# EAGLE schematic arduino-pro-micro (EAGLE 6.5.0)
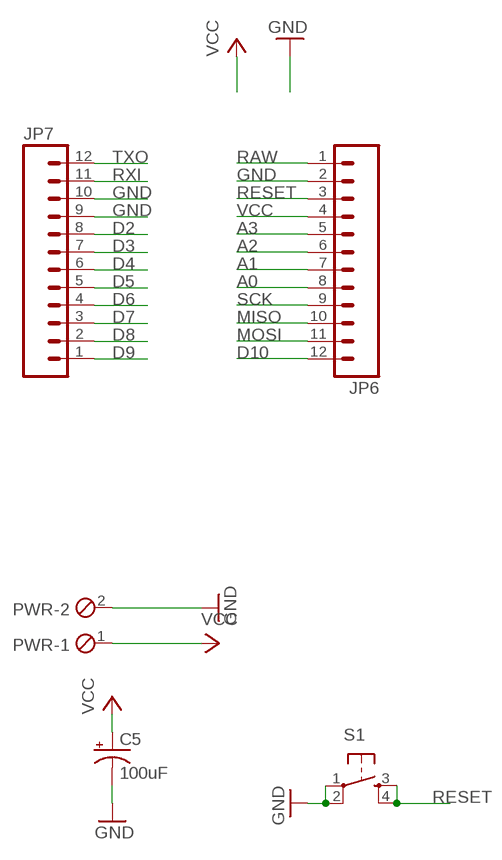
[diagram p0: schematic, sheet 1]

## Parts
C5  100uF  CPOL-USE3.5-8  [E3,5-8]
JP6  M12PTH  [1X12]
JP7  M12PTH  [1X12]
PWR  MPT2  [2POL254]
S1  TAC_SWITCHPTH  [TACTILE-PTH]

## Nets
A0: JP6.8
A1: JP6.7
A2: JP6.6
A3: JP6.5
D2: JP7.8
D3: JP7.7
D4: JP7.6
D5: JP7.5
D6: JP7.4
D7: JP7.3
D8: JP7.2
D9: JP7.1
D10: JP6.12
GND [vcc]: C5.- JP6.2 JP7.9 JP7.10 PWR.2 S1.1 S1.2
MISO: JP6.10
MOSI: JP6.11
RAW [vcc]: JP6.1
RESET: JP6.3 S1.3 S1.4
RXI: JP7.11
SCK: JP6.9
TXO: JP7.12
VCC: C5.+ JP6.4 PWR.1

## Library data of the parts
C5 = rcl:CPOL-US: POLARIZED CAPACITOR, American symbol
JP6 JP7 = SparkFun:M12: Header 12 Standard 12-pin 0.1" header. Use with straight break away headers (SKU : PRT-00116), right angle break away headers (PRT-00553), swiss pins (PRT-00743), machine pins (PRT-00117), and female headers (PRT-00115).
PWR = con-phoenix-254:MPT2: PHOENIX CONNECTOR; OC_FARNELL: unknown; OC_NEWARK: unknown
S1 = SparkFun-Electromechanical:TAC_SWITCH: Momentary Switch Button commonly used for reset or general input. Spark Fun Electronics SKU : COM-00097 SMT- SWCH-08247

## Net classes
0 default: width 0.254 mm
1 vcc: width 0.635 mm